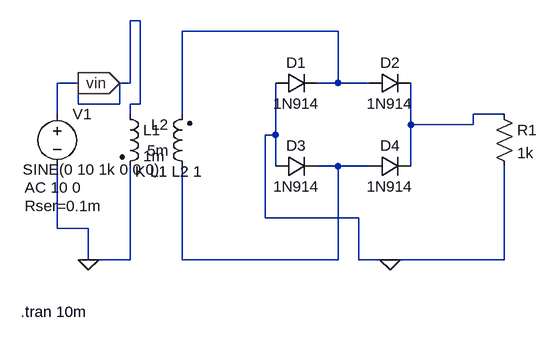
[diagram p0: schematic bridgerec.asc]
bridgerec.asc, the LTspice schematic file:
Version 4
SHEET 1 880 680
WIRE 96 -48 80 -48
WIRE 400 -32 160 -32
WIRE 0 48 -32 48
WIRE 80 48 80 -48
WIRE 80 48 64 48
WIRE 400 48 400 -32
WIRE 400 48 368 48
WIRE 448 48 400 48
WIRE 0 80 0 48
WIRE 64 80 64 48
WIRE 64 80 0 80
WIRE 96 80 96 -48
WIRE 96 80 80 80
WIRE -32 96 -32 48
WIRE 80 96 80 80
WIRE 160 96 160 -32
WIRE 656 96 608 96
WIRE 512 112 512 48
WIRE 608 112 608 96
WIRE 608 112 512 112
WIRE 304 128 304 48
WIRE 304 128 288 128
WIRE 304 176 304 128
WIRE 400 176 368 176
WIRE 448 176 400 176
WIRE 512 176 512 112
WIRE 288 256 288 128
WIRE 432 256 288 256
WIRE -32 272 -32 176
WIRE 16 272 -32 272
WIRE 16 320 16 272
WIRE 80 320 80 176
WIRE 80 320 16 320
WIRE 160 320 160 176
WIRE 400 320 400 176
WIRE 400 320 160 320
WIRE 432 320 432 256
WIRE 480 320 432 320
WIRE 656 320 656 176
WIRE 656 320 480 320
FLAG 16 320 0
FLAG 480 320 0
FLAG 64 48 vin
IOPIN 64 48 In
SYMBOL ind2 64 80 R0
SYMATTR InstName L1
SYMATTR Value 1m
SYMATTR Type ind
SYMBOL ind2 176 192 R180
WINDOW 0 36 80 Left 2
WINDOW 3 36 40 Left 2
SYMATTR InstName L2
SYMATTR Value 5m
SYMATTR Type ind
SYMBOL diode 304 64 R270
WINDOW 0 32 32 VTop 2
WINDOW 3 0 32 VBottom 2
SYMATTR InstName D1
SYMATTR Value 1N914
SYMBOL diode 448 64 R270
WINDOW 0 32 32 VTop 2
WINDOW 3 0 32 VBottom 2
SYMATTR InstName D2
SYMATTR Value 1N914
SYMBOL diode 304 192 R270
WINDOW 0 32 32 VTop 2
WINDOW 3 0 32 VBottom 2
SYMATTR InstName D3
SYMATTR Value 1N914
SYMBOL diode 448 192 R270
WINDOW 0 32 32 VTop 2
WINDOW 3 0 32 VBottom 2
SYMATTR InstName D4
SYMATTR Value 1N914
SYMBOL voltage -32 80 R0
WINDOW 3 -53 101 Left 2
WINDOW 123 -50 129 Left 2
WINDOW 39 -50 157 Left 2
SYMATTR Value SINE(0 10 1k 0 0 0)
SYMATTR Value2 AC 10 0
SYMATTR SpiceLine Rser=0.1m
SYMATTR InstName V1
SYMBOL res 640 80 R0
SYMATTR InstName R1
SYMATTR Value 1k
TEXT 88 184 Left 2 !K L1 L2 1
TEXT -88 400 Left 2 !.tran 10m

The netlist it stands for:
* bridgerec.asc
L1 vin 0 1m
L2 N003 N001 5m
D1 0 N001 1N914
D2 N001 N002 1N914
D3 0 N003 1N914
D4 N003 N002 1N914
V1 vin 0 SINE(0 10 1k 0 0 0) AC 10 0 Rser=0.1m
R1 N002 0 1k
.model D D
.lib standard.dio
K L1 L2 1
.tran 10m
.backanno
.end